# EAGLE schematic Teensy_Board (EAGLE 7.1.0)
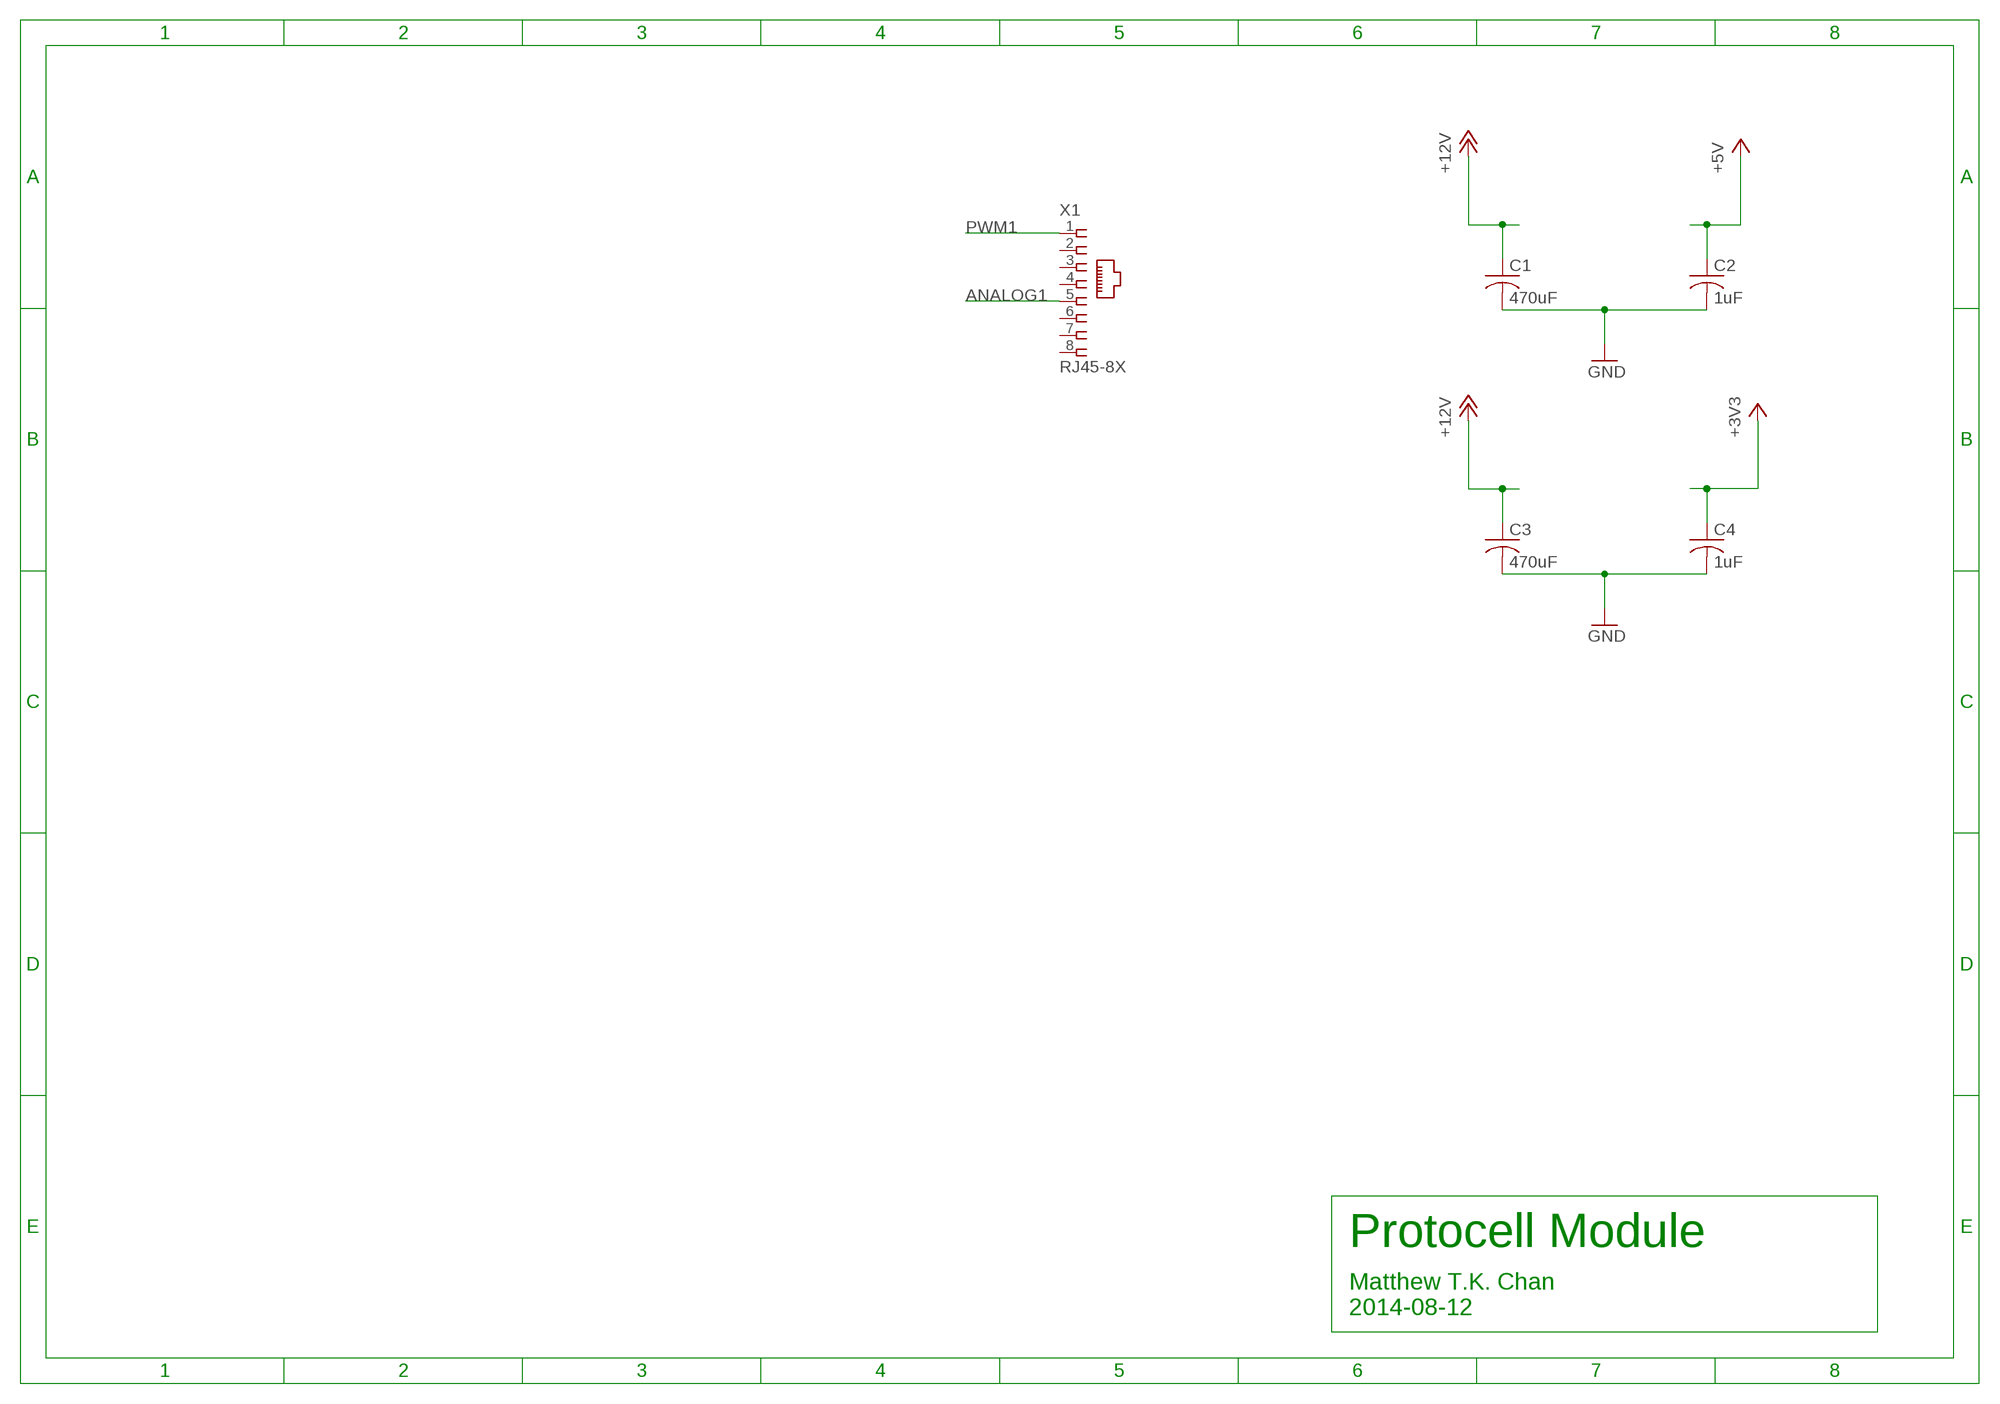
[diagram p0: schematic, sheet 1]

## Parts
C1  470uF  C-USC0603  [C0603]
C2  1uF  C-USC0603  [C0603]
C3  470uF  C-USC0603  [C0603]
C4  1uF  C-USC0603  [C0603]
X1  RJ45-8X  [RJ45-NO-SHIELD]

## Nets
+3V3: C4.1
+5V: C2.1
+12V: C1.1 C3.1
ANALOG1: X1.5
GND: C1.2 C2.2 C3.2 C4.2
PWM1: X1.1
Unconnected: X1.2 X1.3 X1.4 X1.6 X1.7 X1.8

## Notes on the sheet
- Protocell Module
- Matthew T.K. Chan
  2014-08-12

## Library data of the parts
C1-C4 = rcl:C-US: CAPACITOR, American symbol
X1 = CBLA_Test_bed_Library:RJ45: CORCOM Modular RJ Jacks No Shield Source: www.tycoelectronics.com .. ENG_DS_1654001_1099_RJ_L_0507.pdf; MPN: RJ45-8X; OC_FARNELL: unknown; OC_NEWARK: 16R6101